# EasyEDA Pro project Aero1.epro

# Schematic Schematic1
Board Name: Board1; Create Date: 2025-12-23; Page Name: P1; Project Name: Aero1; Schematic Name: Schematic1; Update Date: 2025-12-22; Company: EasyEDA.com; Page Size: A4; Version: V1.0
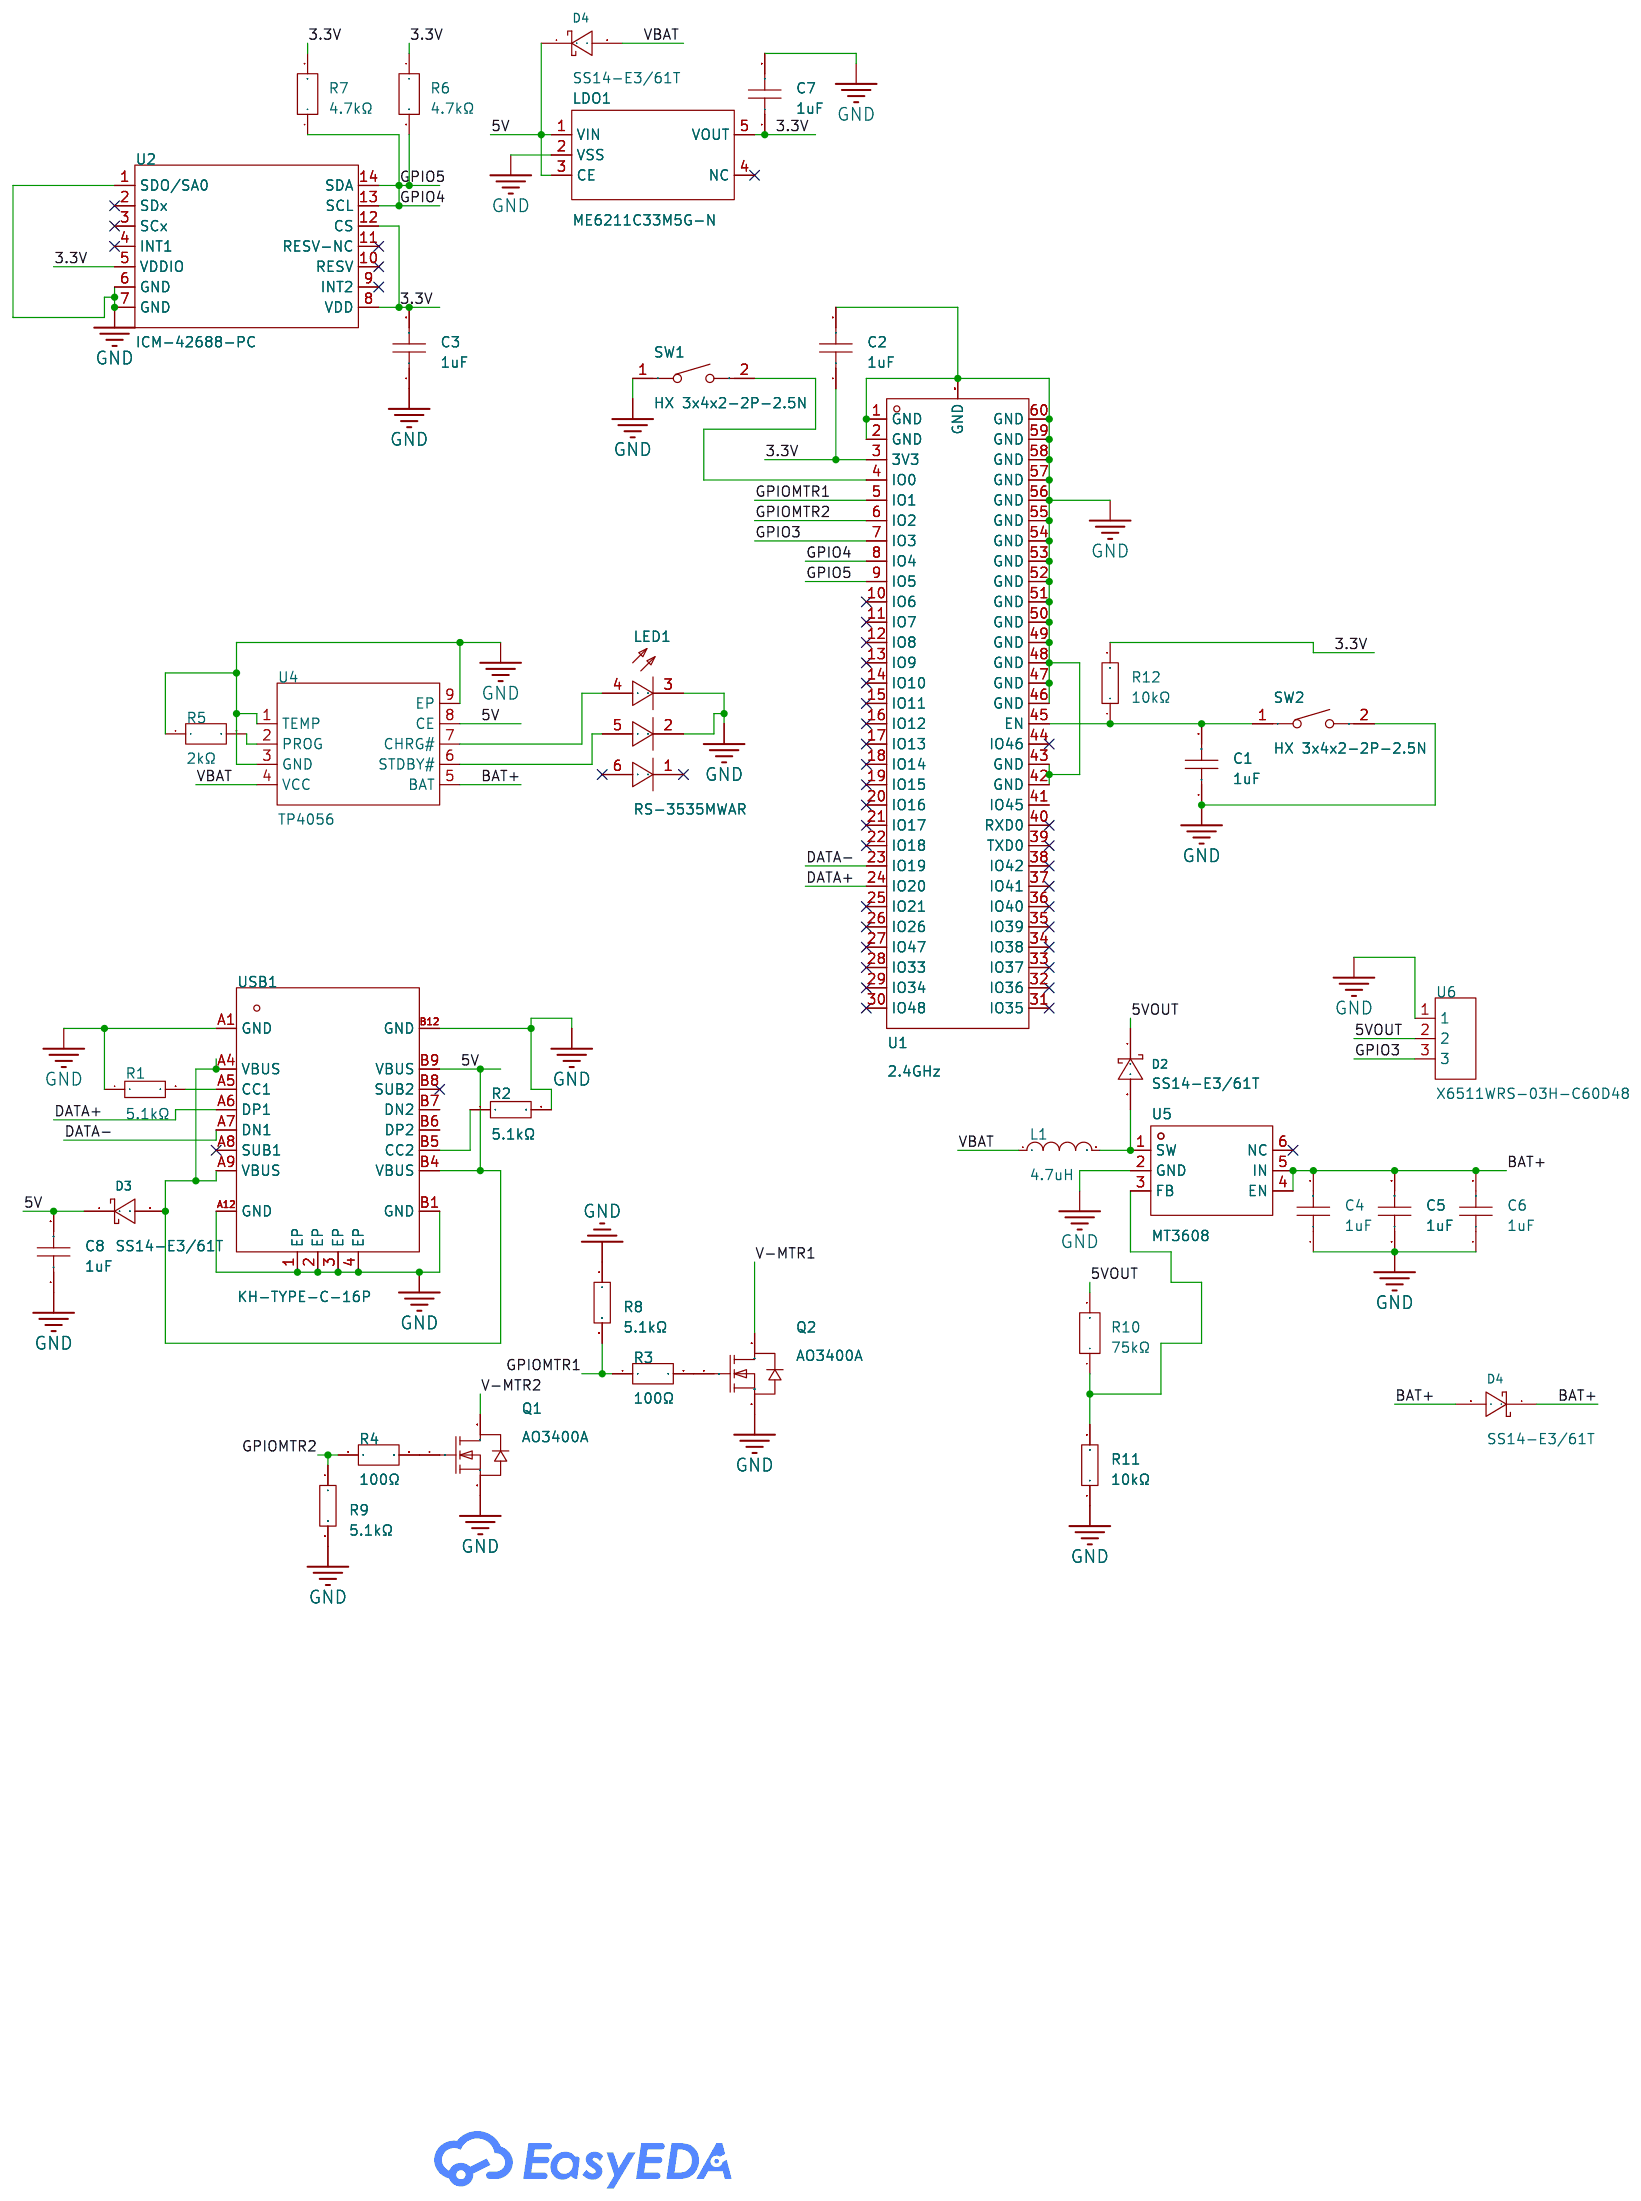
[diagram p0: schematic sheet]

## Parts
C1  1uF  [C1206]
C2  1uF  [C1206]
C3  1uF  [C1206]
C4  1uF  [C1206]
C5  1uF  [C1206]
C6  1uF  [C1206]
C7  1uF  [C1206]
C8  1uF  [C1206]
D2  SS14-E3/61T  [SMA_L4.3-W2.6-LS5.2-RD]
D3  SS14-E3/61T  [SMA_L4.3-W2.6-LS5.2-RD]
D4  SS14-E3/61T  [SMA_L4.3-W2.6-LS5.2-RD]
D4#2  SS14-E3/61T  [SMA_L4.3-W2.6-LS5.2-RD]
L1  4.7uH  [IND-SMD_L3.5-W3.0_ZECD32]
LDO1  ME6211C33M5G-N  [SOT-23-5_L3.0-W1.7-P0.95-LS2.8-BL]
LED1  RS-3535MWAR  [LED-SMD_RS-3535MWAR-2JYJY-J]
Q1  AO3400A  [SOT-23-3_L2.9-W1.3-P1.90-LS2.4-BR]
Q2  AO3400A  [SOT-23-3_L2.9-W1.3-P1.90-LS2.4-BR]
R1  5.1kΩ  [R1206]
R2  5.1kΩ  [R1206]
R3  100Ω  [R2512]
R4  100Ω  [R2512]
R5  2kΩ  [R1206]
R6  4.7kΩ  [R1206]
R7  4.7kΩ  [R1206]
R8  5.1kΩ  [R1206]
R9  5.1kΩ  [R1206]
R10  75kΩ  [R1206]
R11  10kΩ  [R1206]
R12  10kΩ  [R1206]
SW1  HX 3x4x2-2P-2.5N  [SW-SMD_L4.0-W2.9-LS5.0]
SW2  HX 3x4x2-2P-2.5N  [SW-SMD_L4.0-W2.9-LS5.0]
U1  2.4GHz  [BULETM-SMD_ESP32-S3-MINI-1-N8]
U2  ICM-42688-PC  [LGA-14_L3.0-W2.5-P0.50-TL]
U4  TP4056  [ESOP-8_L4.9-W3.9-P1.27-LS6.0-BL-EP]
U5  MT3608  [SOT-23-6_L2.9-W1.6-P0.95-LS2.8-BL]
U6  X6511WRS-03H-C60D48  [HDR-SMD_3P-P2.54-H-M-W13.3-N]
USB1  KH-TYPE-C-16P  [USB-C-SMD_KH-TYPE-C-16P]

## Library data of the parts
C1-C8 = CL31B105KBHNNNE: Capacitance:1uF Tolerance:±10% Tolerance:±10% Voltage Rating:50V Temperature Coefficient:X7R; LCSC Part Name: 1uF ±10% 50V; Supplier Part: C1848; Manufacturer: SAMSUNG(三星); Supplier Footprint: 1206; JLCPCB Part Class: Basic Part; Datasheet: https://item.szlcsc.com/datasheet/CL31B105KBHNNNE/2200.html; Supplier: LCSC; Tolerance: ±10%; Voltage Rating: 50V; Temperature Coefficient: X7R
D2-D4 D4#2 = SS14-E3/61T: Diode Configuration:1 Independent Voltage - Forward(Vf@If):500mV@1A Voltage - DC Reverse(Vr):40V Current - Rectified:1A Reverse Leakage Current (Ir):200uA@40V Operating Junction Temperature Range:-65℃~+150℃ Operating Junction Temperature Range:-65℃~+150℃; LCSC Part Name: 电压:40V 电流:1A; Supplier Part: C47460; Manufacturer: VISHAY(威世); Supplier Footprint: SMA(DO-214AC); JLCPCB Part Class: Extended Part; Datasheet: https://item.szlcsc.com/datasheet/SS14-E3%252F61T/48465.html; Supplier: LCSC; Diode Configuration: 1 Independent; Voltage - Forward(Vf@If): 500mV@1A; Voltage - DC Reverse(Vr): 40V; Current - Rectified: 1A; Reverse Leakage Current (Ir): 200uA@40V; Operating Junction Temperature Range: -65℃~+150℃; Non-Repetitive Peak Forward Surge Current: 40A
L1 = ZECD32-4R7M: Inductance:4.7uH Tolerance:±20% Tolerance:±20% Current Rating:1.5A DC Resistance(DCR):137mΩ Type:Unshielded Inductor; LCSC Part Name: 4.7uH ±20%; Supplier Part: C41408466; Manufacturer: ZE(增益); Supplier Footprint: SMD,3.5x3mm; JLCPCB Part Class: Extended Part; Datasheet: https://item.szlcsc.com/datasheet/ZECD32-4R7M/43210229.html; Supplier: LCSC; Tolerance: ±20%; Current Rating: 1.5A; DC Resistance(DCR): 137mΩ; Type: Unshielded Inductor
LDO1 = ME6211C33M5G-N: Output Type:Fixed Voltage - Supply:6V Output Voltage:3.3V Output Voltage:3.3V Output Current:500mA Power Supply Rejection Ratio (PSRR):70dB@(1kHz) Voltage Dropout:120mV@(100mA) standby current:60uA Noise:50uVrms Features:Over Current Protection；Enable；Sho; LCSC Part Name: 输入6V 输出3.3V 500mA; Supplier Part: C82942; Manufacturer: MICRONE(南京微盟); Supplier Footprint: SOT-23-5; JLCPCB Part Class: Extended Part; Datasheet: https://item.szlcsc.com/datasheet/ME6211C33M5G-N/84106.html; Supplier: LCSC; Output Type: Fixed; Voltage - Supply: 6V; Output Voltage: 3.3V; Output Current: 500mA; Power Supply Rejection Ratio (PSRR): 70dB@(1kHz); Voltage Dropout: 120mV@(100mA); standby current: 60uA; Noise: 50uVrms; Features: Over Current Protection；Enable；Short Circuit Protection; Operating Temperature: -40℃~+150℃; Output Configuration: Positive; Number of Outputs: 1
LED1 = RS-3535MWAR: Diode Configuration:Discrete Diode Wavelength - Dominant:G:527nm；R:622nm；B:471nm Luminous Intensity:G:2200mcd；R:950mcd；B:500mcd Viewing Angle:110° Forward Current:R:20mA；B:20mA；G:20mA Forward Voltage(Vf):R:2V；G:2.9V；B:2.9V Installation Method:op View Moun; LCSC Part Name: TOP全彩LED; Supplier Part: C110402; Manufacturer: 国星光电; Supplier Footprint: SMD3535-6P; JLCPCB Part Class: Extended Part; Datasheet: https://item.szlcsc.com/datasheet/RS-3535MWAR/111625.html; Supplier: LCSC; Diode Configuration: Discrete Diode; Wavelength - Dominant: G:527nm；R:622nm；B:471nm; Luminous Intensity: G:2200mcd；R:950mcd；B:500mcd; Viewing Angle: 110°; Forward Current: R:20mA；B:20mA；G:20mA; Forward Voltage(Vf): R:2V；G:2.9V；B:2.9V; Installation Method: op View Mount; Operating Temperature: -30℃~+85℃
Q1 Q2 = AO3400A_C20917: Number:- Drain to Source Voltage:30V Current - Continuous Drain(Id):- RDS(on):48mΩ@2.5V Pd - Power Dissipation:- Gate Threshold Voltage (Vgs(th)):1.45V@250uA Gate Charge(Qg):7nC@10V Input Capacitance(Ciss):630pF@15V Reverse Transfer Capacitance (Crss@Vds); LCSC Part Name: 1个N沟道 耐压:30V 电流:5.7A; Supplier Part: C20917; Manufacturer: AOS; Supplier Footprint: SOT-23-3L; JLCPCB Part Class: Basic Part; Datasheet: https://item.szlcsc.com/datasheet/AO3400A/21629.html; Supplier: LCSC; Drain to Source Voltage: 30V; RDS(on): 48mΩ@2.5V; Gate Threshold Voltage (Vgs(th)): 1.45V@250uA; Gate Charge(Qg): 7nC@10V; Input Capacitance(Ciss): 630pF@15V; Operating Temperature: -55℃~+150℃@(Tj); Type: N-Channel
R1 R2 R8 R9 = RC1206FR-075K1L: Type:Thick Film Resistor Resistance:5.1kΩ Tolerance:±1% Tolerance:±1% Power(Watts):250mW Voltage-Supply(Max):200V Temperature Coefficient:±100ppm/℃ Temperature Coefficient:±100ppm/℃ Operating Temperature:-55℃~+155℃ Operating Temperature:-55℃~+155℃; LCSC Part Name: 厚膜电阻 5.1kΩ ±1% 250mW; Supplier Part: C163372; Manufacturer: YAGEO(国巨); Supplier Footprint: 1206; JLCPCB Part Class: Extended Part; Datasheet: https://item.szlcsc.com/datasheet/RC1206FR-075K1L/174753.html; Supplier: LCSC; Type: Thick Film Resistor; Tolerance: ±1%; Power(Watts): 250mW; Voltage-Supply(Max): 200V; Temperature Coefficient: ±100ppm/℃; Operating Temperature: -55℃~+155℃
R3 R4 = FRP2512F1000TS: Type:Thick Film Resistor Resistance:100Ω Tolerance:±1% Tolerance:±1% Power(Watts):2W Voltage-Supply(Max):200V Temperature Coefficient:±200ppm/℃ Temperature Coefficient:±200ppm/℃ Operating Temperature:-55℃~+155℃ Operating Temperature:-55℃~+155℃; LCSC Part Name: 100Ω ±1% 2W 厚膜电阻; Supplier Part: C5126189; Manufacturer: FOJAN(富捷); Supplier Footprint: 2512; JLCPCB Part Class: Extended Part; Supplier: LCSC; Type: Thick Film Resistor; Tolerance: ±1%; Power(Watts): 2W; Voltage-Supply(Max): 200V; Temperature Coefficient: ±200ppm/℃; Operating Temperature: -55℃~+155℃
R5 = FRC1206J202 TS: Type:Thick Film Resistor Resistance:2kΩ Tolerance:±5% Tolerance:±5% Power(Watts):250mW Voltage-Supply(Max):200V Temperature Coefficient:±100ppm/℃ Temperature Coefficient:±100ppm/℃ Operating Temperature:-55℃~+155℃ Operating Temperature:-55℃~+155℃; LCSC Part Name: 2kΩ ±5% 250mW 厚膜电阻; Supplier Part: C2907466; Manufacturer: FOJAN(富捷); Supplier Footprint: 1206; JLCPCB Part Class: Extended Part; Supplier: LCSC; Type: Thick Film Resistor; Tolerance: ±5%; Power(Watts): 250mW; Voltage-Supply(Max): 200V; Temperature Coefficient: ±100ppm/℃; Operating Temperature: -55℃~+155℃
R6 R7 = FRC1206J472 TS: Type:Thick Film Resistor Resistance:4.7kΩ Tolerance:±5% Tolerance:±5% Power(Watts):250mW Voltage-Supply(Max):200V Temperature Coefficient:±100ppm/℃ Temperature Coefficient:±100ppm/℃ Operating Temperature:-55℃~+155℃ Operating Temperature:-55℃~+155℃; LCSC Part Name: 4.7kΩ ±5% 250mW 厚膜电阻; Supplier Part: C2907499; Manufacturer: FOJAN(富捷); Supplier Footprint: 1206; JLCPCB Part Class: Extended Part; Supplier: LCSC; Type: Thick Film Resistor; Tolerance: ±5%; Power(Watts): 250mW; Voltage-Supply(Max): 200V; Temperature Coefficient: ±100ppm/℃; Operating Temperature: -55℃~+155℃
R10 = FRC1206J753TS: Type:Thick Film Resistor Resistance:75kΩ Tolerance:±5% Tolerance:±5% Power(Watts):250mW Voltage-Supply(Max):200V Temperature Coefficient:±100ppm/℃ Temperature Coefficient:±100ppm/℃ Operating Temperature:-55℃~+155℃ Operating Temperature:-55℃~+155℃; LCSC Part Name: 75kΩ ±5% 250mW 厚膜电阻; Supplier Part: C2930384; Manufacturer: FOJAN(富捷); Supplier Footprint: 1206; JLCPCB Part Class: Extended Part; Supplier: LCSC; Type: Thick Film Resistor; Tolerance: ±5%; Power(Watts): 250mW; Voltage-Supply(Max): 200V; Temperature Coefficient: ±100ppm/℃; Operating Temperature: -55℃~+155℃
R11 R12 = WR12X103JTL: Type:Thick Film Resistors Resistance: Tolerance:±5% Tolerance:±5% Power(Watts):250mW Overload Voltage (Max): Temperature Coefficient:±100ppm/℃ Temperature Coefficient:±100ppm/℃ Operating Temperature Range:-55℃~+155℃ Operating Temperature Range:-55℃~+155℃; LCSC Part Name: 厚膜电阻 10kΩ ±5% 250mW; Supplier Part: C164022; Manufacturer: Walsin(华新科); Supplier Footprint: 1206; JLCPCB Part Class: Extended Part; Datasheet: https://atta.szlcsc.com/upload/public/pdf/source/20191217/C470038_A24AAB334905FB0194AB4BFA4498611E.pdf; Supplier: LCSC; Type: Thick Film Resistors; Tolerance: ±5%; Power(Watts): 250mW; Temperature Coefficient: ±100ppm/℃; Operating Temperature Range: -55℃~+155℃
SW1 SW2 = HX 3x4x2-2P-2.5N: Circuit:SPST Actuator Style:Round Button Operating Force:2.5N Mounting Type:Surface Mount,Vertical Length:4mm Width:3mm Switch Height:2mm with Bracket:Without Bracket Contact Current:50mA Voltage Rating:12V Actuator/Cap Color:Black With Lamp:No IP Rating:; LCSC Part Name: 4*3*2mm 立贴 轻触开关; Supplier Part: C36498961; Manufacturer: hanxia(韩下); Supplier Footprint: SMD,3x4mm; JLCPCB Part Class: Extended Part; Datasheet: https://item.szlcsc.com/datasheet/HX%25203x4x2-2P-2.5N/38220903.html; Supplier: LCSC; Circuit: SPST; Actuator Style: Round Button; Operating Force: 2.5N; Mounting Type: Surface Mount,Vertical; Length: 4mm; Width: 3mm; Switch Height: 2mm; with Bracket: Without Bracket; Contact Current: 50mA; Voltage Rating: 12V; Actuator/Cap Color: Black; With Lamp: No; Termination Style: SMD(SMT) Tab; Life: 100,000 Cycles
U1 = ESP32-S3-MINI-1-N8: Core Processor:ESP32-S3FN8 Chip Wireless Standard:- Support Interface:I2C；GPIO；SPI；PWM；ADC；UART；USB；I2S Frequency:2.4GHz Antenna Type:- Output Power:20.5dBm Output Power:20.5dBm Operating Voltage:- Operating Voltage:- Receive  Current:- Send  Current:- Se; Supplier Part: C2913206; Manufacturer: ESPRESSIF(乐鑫); Supplier Footprint: SMD; JLCPCB Part Class: Extended Part; Datasheet: https://atta.szlcsc.com/upload/public/pdf/source/20220425/7F117D7A09F85946280540FD9EFDF9F3.pdf; Supplier: LCSC; Core Processor: ESP32-S3FN8 Chip; Support Interface: I2C；GPIO；SPI；PWM；ADC；UART；USB；I2S; Output Power: 20.5dBm
U2 = ICM-42688-PC: Accelerometer Sensing Axis:X,Y,Z Acceleration Measurement Range (MAX):±16g Acceleration Measurement Range (MAX):±16g Gyroscope Sensing Axis:X,Y,Z Gyroscope Measurement Range (MAX):±2048dps Gyroscope Measurement Range (MAX):±2048dps Sensor Type:IMU Output; LCSC Part Name: 低噪声、宽带宽6D惯性测量单元，带运动协处理器; Supplier Part: C48586483; Manufacturer: Tokmas(托克马斯); Supplier Footprint: LGA-14(2.5x3); JLCPCB Part Class: Extended Part; Datasheet: https://item.szlcsc.com/datasheet/ICM-42688-PC/50854565.html; Supplier: LCSC; Accelerometer Sensing Axis: X,Y,Z; Acceleration Measurement Range (MAX): ±16g; Gyroscope Sensing Axis: X,Y,Z; Gyroscope Measurement Range (MAX): ±2048dps; Sensor Type: IMU; Output Bits: 16bit; Interface: I3C；I2C；SPI; Voltage - Supply: 1.71V~3.6V; Cache Size: 1.5KB; Operating Temperature: -40℃~+85℃
U4 = TP4056_C725790: The Chip Type:Linear Charging IC Voltage - Supply:3.7V~6.5V Voltage - Supply:3.7V~6.5V Charge Current - Max:1A Charging Saturation Voltage:4.2V Type of Battery:Lithium-ion Number of Cells:1 Number of Cells:1 Operating Temperature:-40℃~+85℃ Operating Tempe; LCSC Part Name: 1A独立式线性锂离子电池充电器; Supplier Part: C725790; Manufacturer: UMW(友台半导体); Supplier Footprint: ESOP-8; JLCPCB Part Class: Extended Part; Datasheet: https://item.szlcsc.com/datasheet/TP4056/772193.html; Supplier: LCSC; The Chip Type: Linear Charging IC; Voltage - Supply: 3.7V~6.5V; Charge Current - Max: 1A; Charging Saturation Voltage: 4.2V; Type of Battery: Lithium-ion; Number of Cells: 1; Operating Temperature: -40℃~+85℃; Battery Temperature Detection: Support; 0V Battery Charge: Support; Supply Current (Iq): 35uA
U5 = MT3608: Function:Boost Output Type:Adjustable Voltage - Supply:2V~24V Voltage - Supply:2V~24V Output Voltage:- Output Voltage:- Output Current:2A Frequency - Switching:1.2MHz Frequency - Switching:1.2MHz Operating Temperature:-40℃~+85℃ Operating Temperature:-40℃~; LCSC Part Name: 老版本 高效1.2MHz 2A升压转换器; Supplier Part: C84817; Manufacturer: 西安航天民芯; Supplier Footprint: SOT-23-6; JLCPCB Part Class: Extended Part; Datasheet: https://item.szlcsc.com/datasheet/MT3608/85988.html; Supplier: LCSC; Function: Boost; Output Type: Adjustable; Voltage - Supply: 2V~24V; Output Current: 2A; Frequency - Switching: 1.2MHz; Operating Temperature: -40℃~+85℃; Synchronous Rectifier: No; Number of Outputs: 1; Topology: Boost; Quiescent Current: 100uA；1.6mA; Switch tube (built-in/external): Built-in
U6 = X6511WRS-03H-C60D48: Pin Structure:1x3P Pitch:2.54mm Row Spacing:2.54mm Circluar Pins/Square Pins:Pin Header Number of Rows:1 Number of Pins:3P Current Rating:3A Voltage Rating (Max):250V Length of Mating Pin:- Insulation Height:2.5mm Length of End Connection Pin:- Contact Ma; LCSC Part Name: 1x3P 间距:2.54mm 方针; Supplier Part: C5242196; Manufacturer: XKB Connection(中国星坤); Supplier Footprint: SMD,P=2.54mm; JLCPCB Part Class: Extended Part; Datasheet: https://item.szlcsc.com/datasheet/X6511WRS-03H-C60D48/5950303.html; Supplier: LCSC; Pin Structure: 1x3P; Pitch: 2.54mm; Row Spacing: 2.54mm; Circluar Pins/Square Pins: Pin Header; Number of Rows: 1; Number of Pins: 3P; Current Rating: 3A; Voltage Rating (Max): 250V; Insulation Height: 2.5mm; Contact Material: Brass; Contact Plating: Gold; Operating Temperature: -40℃~+105℃; Color: Black
USB1 = KH-TYPE-C-16P: Connector Type:Type-C Standard:- Gender:Female Number of Ports:1 Number of Contacts:16P Mounting Style:卧贴 Current Rating - Power (Max):3A Operating Temperature Range:-40℃~+85℃ Operating Temperature Range:-40℃~+85℃; LCSC Part Name: Type-C 母 卧贴; Supplier Part: C709357; Manufacturer: kinghelm(金航标); Supplier Footprint: SMD; JLCPCB Part Class: Extended Part; Datasheet: https://atta.szlcsc.com/upload/public/pdf/source/20200911/C709357_AA8DCEB38BB20E3035A7ED7AE7667837.pdf; Supplier: LCSC; Connector Type: Type-C; Gender: Female; Number of Ports: 1; Number of Contacts: 16P; Mounting Style: 卧贴; Current Rating - Power (Max): 3A; Operating Temperature Range: -40℃~+85℃

## Nets
3.3V: C2.1 C3.2 C7.1 LDO1.5(VOUT) R6.1 R7.2 R12.2 U1.3(3V3) U2.5(VDDIO) U2.8(VDD) U2.12(CS)
5V: C8.2 D3.1(K) D3.2(A) D4.1(K) LDO1.1(VIN) LDO1.3(CE) U4.8(CE) USB1.A4(VBUS) USB1.A9(VBUS) USB1.B4(VBUS) USB1.B9(VBUS)
5VOUT: D2.1(K) R10.2 U6.2
GND: C1.1 C2.2 C3.1 C4.1 C5.1 C6.1 C7.2 C8.1 LDO1.2(VSS) LED1.2(K) LED1.3(K) Q1.2(S) Q2.2(S) R1.1 R2.2 R5.1 R8.1 R9.2 R11.1 SW1.1 SW2.2 U1.1(GND) U1.2(GND) U1.42(GND) U1.43(GND) U1.46(GND) U1.47(GND) U1.48(GND) U1.49(GND) U1.50(GND) U1.51(GND) U1.52(GND) U1.53(GND) U1.54(GND) U1.55(GND) U1.56(GND) U1.57(GND) U1.58(GND) U1.59(GND) U1.60(GND) U1.GND U2.1(SDO/SA0) U2.6(GND) U2.7(GND) U4.1(TEMP) U4.3(GND) U4.9(EP) U5.2(GND) U6.1 USB1.1(EP) USB1.2(EP) USB1.3(EP) USB1.4(EP) USB1.A1(GND) USB1.A12(GND) USB1.B1(GND) USB1.B12(GND)
VBAT: D4.2(A) L1.1 U4.4(VCC)
BAT+: C4.2 C5.2 C6.2 D4#2.1(K) D4#2.2(A) U4.5(BAT) U5.4(EN) U5.5(IN)
DATA+: U1.24(IO20) USB1.A6(DP1)
DATA-: U1.23(IO19) USB1.A7(DN1)
GPIO3: U1.7(IO3) U6.3
GPIO4: R7.1 U1.8(IO4) U2.13(SCL)
GPIO5: R6.2 U1.9(IO5) U2.14(SDA)
GPIOMTR1: R3.1 R8.2 U1.5(IO1)
GPIOMTR2: R4.1 R9.1 U1.6(IO2)
V-MTR1: Q2.3(D)
V-MTR2: Q1.3(D)
$1N1566: R1.2 USB1.A5(CC1)
$1N1605: R2.1 USB1.B5(CC2)
$1N2351: Q2.1(G) R3.2
$1N2390: Q1.1(G) R4.2
$1N2578: R5.2 U4.2(PROG)
$1N2654: LED1.4(A) U4.7(CHRG#)
$1N2866: LED1.5(A) U4.6(STDBY#)
$1N3463: D2.2(A) L1.2 U5.1(SW)
$1N3668: R10.1 R11.2 U5.3(FB)
$1N3802: C1.2 R12.1 SW2.1 U1.45(EN)
$1N3847: SW1.2 U1.4(IO0)

Not connected (* = marked no-connect by the designer): LDO1 4(NC)*; LED1 1(K)* 6(A)*; U1 10(IO6)* 11(IO7)* 12(IO8)* 13(IO9)* 14(IO10)* 15(IO11)* 16(IO12)* 17(IO13)* 18(IO14)* 19(IO15)* 20(IO16)* 21(IO17)* 22(IO18)* 25(IO21)* 26(IO26)* 27(IO47)* 28(IO33)* 29(IO34)* 30(IO48)* 31(IO35)* 32(IO36)* 33(IO37)* 34(IO38)* 35(IO39)* 36(IO40)* 37(IO41)* 38(IO42)* 39(TXD0)* 40(RXD0)* 41(IO45) 44(IO46)*; U2 2(SDx)* 3(SCx)* 4(INT1)* 9(INT2)* 10(RESV)* 11(RESV-NC)*; U5 6(NC)*; USB1 A8(SUB1)* B6(DP2) B7(DN2) B8(SUB2)*

# Board PCB1
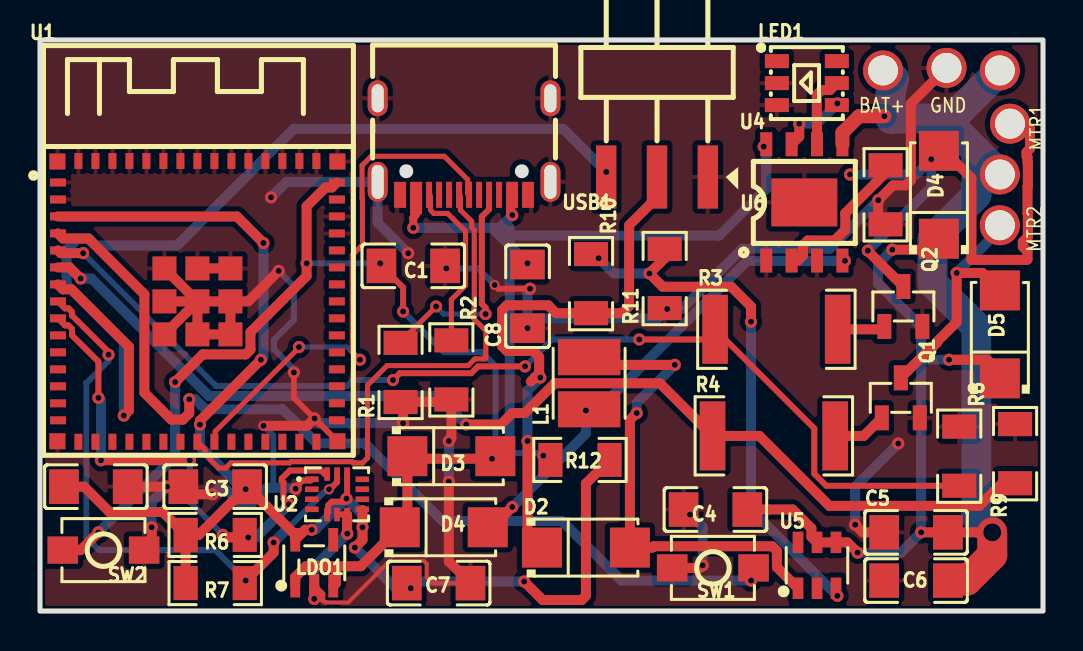
[diagram p1: board, top side]
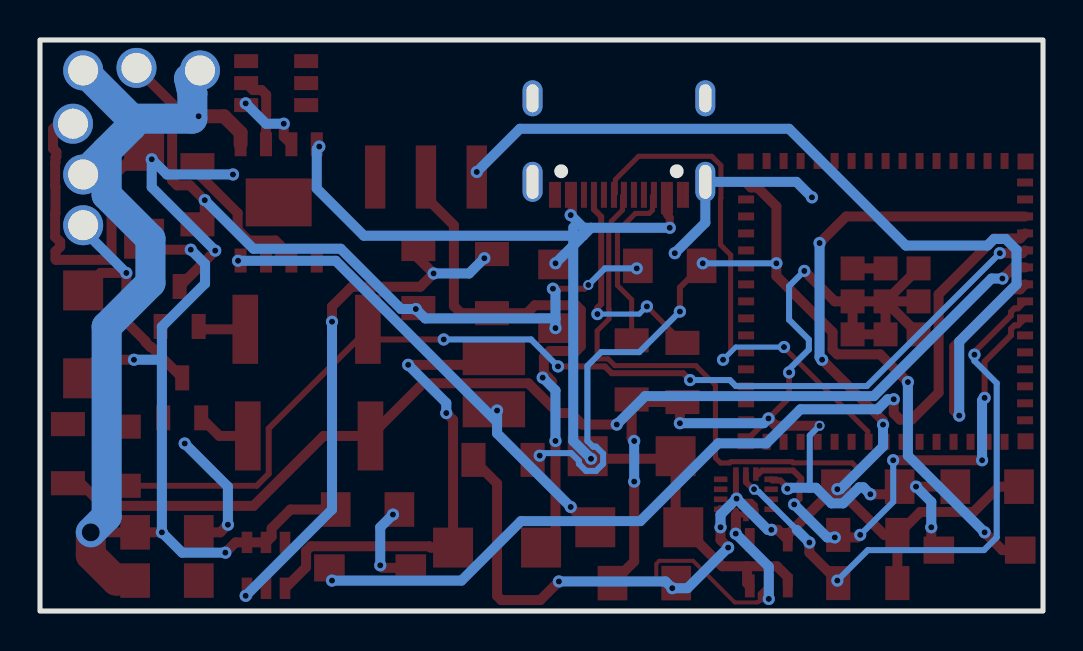
[diagram p2: board, bottom side, seen from below]

Outline 50.16 x 28.58 mm; copper layers: Top Layer, Bottom Layer. Coordinates in mm from the lower left corner of the outline.
Outline path: rectangle 0,28.58 50.16,0
Stack: Top Layer 0.035mm / Dielectric1 1.51mm FR4 er 4.5 / Bottom Layer 0.035mm

## Design rules (mm)
template: Custom Config
spacing copperThickness1oz (default): track to track 0.102, other pairs 0.152 to 0.3
spacing copperThickness2oz: track to track 0.203, other pairs 0.152 to 0.3
track width copperThickness1oz: min 0.127, default 0.254, max 2.54
track width copperThickness2oz: min 0.203, default 0.254, max 2.54
track width PWR_5v: min 0.127, default 0.5, max 2.54
track width PWR_3.3v (default): min 0.127, default 0.5, max 2.54
differential pair differentialPair (default): width min 0.127, default 0.254, max 2.54; gap min 0.152, default 0.152
via viaSize (default): diameter min 0.5, default 0.61, max 10; hole min 0.3, default 0.305, max 6.3

## Placement (name value [footprint] x y rotation side)
C1  1uF  [C1206]  18.67 17.27 180 top
C2  1uF  [C1206]  2.79 6.22 0 top
C3  1uF  [C1206]  8.76 6.22 0 top
C4  1uF  [C1206]  33.78 5.08 0 top
C5  1uF  [C1206]  43.81 3.94 0 top
C6  1uF  [C1206]  43.81 1.52 0 top
C7  1uF  [C1206]  19.94 1.4 0 top
C8  1uF  [C1206]  24.38 15.75 90 top
D2  SS14-E3/61T  [SMA_L4.3-W2.6-LS5.2-RD]  27.31 3.17 0 top
D3  SS14-E3/61T  [SMA_L4.3-W2.6-LS5.2-RD]  20.57 7.75 0 top
D4  SS14-E3/61T  [SMA_L4.3-W2.6-LS5.2-RD]  44.96 20.83 90 top
D4#2  SS14-E3/61T  [SMA_L4.3-W2.6-LS5.2-RD]  20.19 4.19 0 top
D5  SS14-E3/61T  [SMA_L4.3-W2.6-LS5.2-RD]  48.01 13.84 90 top
L1  4.7uH  [IND-SMD_L3.5-W3.0_ZECD32]  27.47 11.4 90 top
LDO1  ME6211C33M5G-N  [SOT-23-5_L3.0-W1.7-P0.95-LS2.8-BL]  13.72 2.41 0 top
LED1  RS-3535MWAR  [LED-SMD_RS-3535MWAR-2JYJY-J]  38.35 26.42 0 top
NOREF  -  [Pad_e51]  48.01 19.3 0 top
NOREF#2  -  [Pad_e49]  48.51 24.38 0 top
NOREF#3  -  [Pad_e48]  48.01 27.05 0 top
NOREF#4  -  [Pad_e50]  48.01 21.84 0 top
NOREF#5  -  [Pad_e46]  45.34 27.18 0 top
NOREF#6  -  [Pad_e45]  42.16 27.05 0 top
Q1  AO3400A  [SOT-23-3_L2.9-W1.3-P1.90-LS2.4-BR]  43.05 10.67 270 top
Q2  AO3400A  [SOT-23-3_L2.9-W1.3-P1.90-LS2.4-BR]  43.18 15.24 270 top
R1  5.1kΩ  [R1206]  18.03 11.94 90 top
R2  5.1kΩ  [R1206]  20.57 12.06 270 top
R3  100Ω  [R2512]  36.83 14.1 0 top
R4  100Ω  [R2512]  36.7 8.76 0 top
R5  2kΩ  [R1206]  42.29 20.83 90 top
R6  4.7kΩ  [R1206]  8.76 3.81 0 top
R7  4.7kΩ  [R1206]  8.76 1.4 180 top
R8  5.1kΩ  [R1206]  45.97 7.75 270 top
R9  5.1kΩ  [R1206]  48.77 7.87 90 top
R10  75kΩ  [R1206]  27.56 16.38 270 top
R11  10kΩ  [R1206]  31.24 16.64 90 top
R12  10kΩ  [R1206]  27.01 7.56 0 top
SW1  HX 3x4x2-2P-2.5N  [SW-SMD_L4.0-W2.9-LS5.0]  33.66 2.16 0 top
SW2  HX 3x4x2-2P-2.5N  [SW-SMD_L4.0-W2.9-LS5.0]  3.18 3.05 0 top
U1  2.4GHz  [BULETM-SMD_ESP32-S3-MINI-1-N8]  7.87 15.49 0 top
U2  ICM-42688-PC  [LGA-14_L3.0-W2.5-P0.50-TL]  14.86 5.84 0 top
U4  TP4056  [ESOP-8_L4.9-W3.9-P1.27-LS6.0-BL-EP]  38.23 20.45 0 top
U5  MT3608  [SOT-23-6_L2.9-W1.6-P0.95-LS2.8-BL]  38.86 2.29 0 top
U6  X6511WRS-03H-C60D48  [HDR-SMD_3P-P2.54-H-M-W13.3-N]  30.86 21.72 180 top
USB1  KH-TYPE-C-16P  [USB-C-SMD_KH-TYPE-C-16P]  21.21 23.24 180 top

## Footprints (pads in the part's own frame, mm; a bottom-side part is the same pattern mirrored in y, then rotated)
BULETM-SMD_ESP32-S3-MINI-1-N8
  rect 0.8x0.4 smd: 1(-6.975,5.95) 2(-6.975,5.1) 3(-6.975,4.25) 4(-6.975,3.4) 5(-6.975,2.55) 6(-6.975,1.7) 7(-6.975,0.85) 8(-6.975,0) 9(-6.975,-0.85) 10(-6.975,-1.7) 11(-6.975,-2.55) 12(-6.975,-3.4) 13(-6.975,-4.25) 14(-6.975,-5.1) 15(-6.975,-5.95) 31(6.975,-5.95) 32(6.975,-5.1) 33(6.975,-4.25) 34(6.975,-3.4) 35(6.975,-2.55) 36(6.975,-1.7) 37(6.975,-0.85) 38(6.975,0) 39(6.975,0.85) 40(6.975,1.7) 41(6.975,2.55) 42(6.975,3.4) 43(6.975,4.25) 44(6.975,5.1) 45(6.975,5.95)
  rect 0.4x0.8 smd: 16(-5.95,-7.025) 17(-5.1,-7.025) 18(-4.25,-7.025) 19(-3.4,-7.025) 20(-2.55,-7.025) 21(-1.7,-7.025) 22(-0.85,-7.025) 23(0,-7.025) 24(0.85,-7.025) 25(1.7,-7.025) 26(2.55,-7.025) 27(3.4,-7.025) 28(4.25,-7.025) 29(5.1,-7.025) 30(5.95,-7.025) 46(5.95,7.025) 47(5.1,7.025) 48(4.25,7.025) 49(3.4,7.025) 50(2.55,7.025) 51(1.7,7.025) 52(0.85,7.025) 53(0,7.025) 54(-0.85,7.025) 55(-1.7,7.025) 56(-2.55,7.025) 57(-3.4,7.025) 58(-4.25,7.025) 59(-5.1,7.025) 60(-5.95,7.025)
  rect 0.8x0.8 smd: GND(-7,7) GND(-7,-7) GND(7,7) GND(7,-7)
  rect 1.2x1.2 smd: GND(-1.65,1.65) GND(-1.65,0) GND(-1.65,-1.65) GND(0,1.65) GND(0,0) GND(0,-1.65) GND(1.65,1.65) GND(1.65,0) GND(1.65,-1.65)
C1206
  rect 1.485x1.728 smd: 1(-1.593,0) 2(1.593,0)
ESOP-8_L4.9-W3.9-P1.27-LS6.0-BL-EP
  rect 0.6x1.2 smd: 1(-1.905,-2.909) 2(-0.635,-2.909) 3(0.635,-2.909) 4(1.905,-2.909) 5(1.905,2.909) 6(0.635,2.909) 7(-0.635,2.909) 8(-1.905,2.909)
  rect 3.3x2.4 smd: 9(0,0)
HDR-SMD_3P-P2.54-H-M-W13.3-N
  rect 1.02x3.16 smd: 1(-2.54,0) 2(0,0) 3(2.54,0)
IND-SMD_L3.5-W3.0_ZECD32
  rect 1.8x3.12 smd: 1(-1.303,0) 2(1.303,0)
LED-SMD_RS-3535MWAR-2JYJY-J
  rect 1.2x0.7 smd: 1(-1.5,1.1) 2(-1.5,0) 3(-1.5,-1.1) 4(1.5,-1.1) 5(1.5,0.001) 6(1.5,1.1)
LGA-14_L3.0-W2.5-P0.50-TL
  rect 0.675x0.28 smd: 1(-1.262,0.75) 2(-1.262,0.25) 3(-1.262,-0.25) 4(-1.262,-0.75) 8(1.262,-0.75) 9(1.262,-0.25) 10(1.262,0.25) 11(1.262,0.75)
  rect 0.28x0.675 smd: 5(-0.5,-1.012) 6(0,-1.012) 7(0.5,-1.012) 12(0.5,1.012) 13(0,1.012) 14(-0.5,1.012)
Pad_e45
  round 2 hole 1.5: 1(0,0)
Pad_e46
  round 2 hole 1.5: 2(0,0)
Pad_e48
  round 2 hole 1.5: 1(0,0)
Pad_e49
  round 2 hole 1.5: 2(0,0)
Pad_e50
  round 2 hole 1.5: 1(0,0)
Pad_e51
  round 2 hole 1.5: 2(0,0)
R1206
  rect 1.208x1.701 smd: 1(-1.479,0) 2(1.479,0)
R2512
  rect 1.282x3.456 smd: 1(-3.067,0) 2(3.067,0)
SMA_L4.3-W2.6-LS5.2-RD
  rect 2x2 smd: 1(-2.2,0) 2(2.2,0)
SOT-23-3_L2.9-W1.3-P1.90-LS2.4-BR
  rect 1.25x0.7 smd: 1(1,-0.95) 2(1,0.95) 3(-1,0)
SOT-23-5_L3.0-W1.7-P0.95-LS2.8-BL
  rect 0.49x1.157 smd: 1(-0.95,-1.153) 2(0,-1.153) 3(0.95,-1.153)
  rect 0.49x1.175 smd: 4(0.95,1.153) 5(-0.95,1.153)
SOT-23-6_L2.9-W1.6-P0.95-LS2.8-BL
  rect 0.532x1.072 smd: 1(-0.95,-1.149) 2(0,-1.149) 3(0.95,-1.149) 4(0.95,1.149) 5(0,1.149) 6(-0.95,1.149)
SW-SMD_L4.0-W2.9-LS5.0
  rect 1.53x1.36 smd: 1(-2.035,0) 2(2.035,0)
USB-C-SMD_KH-TYPE-C-16P
  oval 1x2 hole 0.6x1.7: 1(-4.32,1.765) 2(4.32,1.765)
  oval 1x1.8 hole 0.6x1.4: 3(-4.32,-2.415) 4(4.32,-2.415)
  rect 0.3x1.3 smd: A1(-3.35,2.415) A4(-2.55,2.415) A5(-1.25,2.415) A6(-0.25,2.415) A7(0.25,2.415) A8(1.25,2.415) A9(2.55,2.415) A12(3.35,2.415) B1(3.05,2.415) B4(2.25,2.415) B5(1.75,2.415) B6(0.75,2.415) B7(-0.75,2.415) B8(-1.75,2.415) B9(-2.25,2.415) B12(-3.05,2.415)

## Nets
3.3V: C2.1 C3.2 C7.1 LDO1.5 R6.1 R7.2 R12.2 U1.3 U2.5 U2.8 U2.12
5V: C8.2 D3.1 D3.2 D4#2.1 LDO1.1 LDO1.3 U4.8 USB1.A4 USB1.A9 USB1.B4 USB1.B9
5VOUT: D2.1 R10.2 U6.2
GND: C1.1 C2.2 C3.1 C4.1 C5.1 C6.1 C7.2 C8.1 LDO1.2 LED1.2 LED1.3 NOREF#5.2 Q1.2 Q2.2 R1.1 R2.2 R5.1 R8.1 R9.2 R11.1 SW1.1 SW2.2 U1.1 U1.2 U1.42 U1.43 U1.46 U1.47 U1.48 U1.49 U1.50 U1.51 U1.52 U1.53 U1.54 U1.55 U1.56 U1.57 U1.58 U1.59 U1.60 U1.GND U2.1 U2.6 U2.7 U4.1 U4.3 U4.9 U5.2 U6.1 USB1.1 USB1.2 USB1.3 USB1.4 USB1.A1 USB1.A12 USB1.B1 USB1.B12
VBAT: D4#2.2 L1.1 U4.4
BAT+: C4.2 C5.2 C6.2 D4.1 D5.1 NOREF#3.1 NOREF#4.1 NOREF#6.1 U4.5 U5.4 U5.5
DATA+: U1.24 USB1.A6
DATA-: U1.23 USB1.A7
GPIO3: U1.7 U6.3
GPIO4: R7.1 U1.8 U2.13
GPIO5: R6.2 U1.9 U2.14
GPIOMTR1: R3.1 R8.2 U1.5
GPIOMTR2: R4.1 R9.1 U1.6
V-MTR1: D4.2 NOREF#2.2 Q2.3
V-MTR2: D5.2 NOREF.2 Q1.3
$1N1566: R1.2 USB1.A5
$1N1605: R2.1 USB1.B5
$1N2351: Q2.1 R3.2
$1N2390: Q1.1 R4.2
$1N2578: R5.2 U4.2
$1N2654: LED1.4 U4.7
$1N2866: LED1.5 U4.6
$1N3463: D2.2 L1.2 U5.1
$1N3668: R10.1 R11.2 U5.3
$1N3802: C1.2 R12.1 SW2.1 U1.45
$1N3847: SW1.2 U1.4

Pads without a net: LDO1 4; LED1 1 6; U1 10 11 12 13 14 15 16 17 18 19 20 21 22 25 26 27 28 29 30 31 32 33 34 35 36 37 38 39 40 41 44; U2 2 3 4 9 10 11; U5 6; USB1 A8 B6 B7 B8

## Via types
v1: diameter 0.61, hole 0.305, Top Layer to Bottom Layer, 89 vias
v2: diameter 0.5, hole 0.3, Top Layer to Bottom Layer, 2 vias
v3: diameter 0.5, hole 0.305, Top Layer to Bottom Layer, 1 via
v4: diameter 1.2, hole 0.9, Top Layer to Bottom Layer, 1 via

## Routing (per net, layer and track width the routed paths; a pad name or vN(x,y) marks a point on that pad's centre or on a via; arc(x,y) is an arc through that point)
3.3V: length 73.1
  Top Layer w0.3: U2.5 14.36,4.87 14.42,4.93 14.42,5.29 14.59,5.47 15.17,5.47 v1(15.33,5.62) 15.36,5.66 U2.12
  Top Layer w0.5: v1(15.75,3.17) 16.13,3.56 v1(16.13,4.19) 16.13,5.04 16.12,5.05 ; v1(11.18,18.41) 9.85,19.74 U1.3 ; 8,9.27 8,9.53 v1(11.05,12.57) ; R6.1 6.14,4.96 3.48,4.96 2.21,6.22 C2.1 ; R6.1 7.94,3.81 C3.2 12.77,3.81 LDO1.5 13.26,4.06 v1(13.59,4.06) ; R6.1 R7.2 ; v1(24.21,1.48) 25.14,0.55 27.09,0.55 27.31,0.76 27.31,6.38 R12.2
  Bottom Layer w0.5: v1(11.05,12.57) 11.18,12.7 v1(11.18,18.41) ; v1(15.75,3.17) 17.78,1.14 v1(18.54,1.14) 18.88,1.48 v1(24.21,1.48) ; v1(16.13,4.19) 16.13,4.82 v1(15.33,5.62) 13.77,4.06 v1(13.59,4.06) ; v1(10.29,6.1) 10.14,6.1 8,8.23 v1(8,9.33)
5V: length 56.9
  Top Layer w0.3: USB1.B9 23.46,20.78 23.5,20.74 23.46,20.69 23.46,19.97 v1(23.62,19.81) 23.62,20.69 USB1.A4 ; USB1.B4 18.96,19.97 18.8,19.81 18.66,19.95 USB1.A9
  Top Layer w0.4: v1(18.67,19.18) 18.67,19.69 18.8,19.81
  Top Layer w0.5: LDO1.3 14.8,1.39 14.8,2.24 ; v1(22.61,7.62) 18.5,7.62 18.37,7.75 18.37,4.57 D4#2.1 16.04,2.24 14.8,2.24 ; 14.8,2.24 13.3,2.24 12.77,1.7 LDO1.1
  Bottom Layer w0.5: v1(22.61,7.62) 23.5,8.51 23.5,18.29 ; 23.5,18.29 v1(24.38,17.4) ; 23.5,18.29 23.5,18.78 ; 23.5,18.29 23,18.78 ; 23.5,19.19 23.5,18.78 ; 23.5,18.78 33.96,18.78 36.32,21.14 36.32,23.11 v1(36.19,23.24) ; 23.5,18.78 23,18.78 ; 22.61,19.18 23,18.78 ; 22.61,19.18 22.99,19.18 v1(23.62,19.81) ; 22.61,19.18 v1(18.67,19.18)
5VOUT: length 28.4
  Top Layer w0.5: 24.75,11.68 24.96,11.9 24.96,12.71 24.66,13.01 23.35,13.01 23.12,13.25 23.12,15.06 23.35,15.3 25.41,15.3 25.81,14.9 R10.2 29.11,14.9 29.46,15.26 29.46,19.3 30.86,20.7 U6.2 ; 24.75,11.68 v1(25.02,11.68) ; 24.75,11.68 24.55,11.48 ; D2.1 24.38,3.9 v1(24.38,8.51)
  Bottom Layer w0.5: v1(24.38,8.51) 24.38,11.04 v1(25.02,11.68)
GND: length 139.3
  Top Layer w0.2: 14.12,0.56 14.23,0.44 14.3,0.44 14.32,0.43 15.42,0.43 17.5,2.51 19.19,2.51 19.34,2.37 19.34,1.68 19.63,1.4 C7.2
  Top Layer w0.29: v1(12.7,11.94) 12.7,10.67 v1(13.73,9.64) U1.GND
  Top Layer w0.3: v1(12.79,6.12) 12.79,6.19 13.13,6.53 13.54,6.53 U2.1 ; U2.7 U2.6 ; v1(24.51,16.13) 22.93,16.13 v2(22.74,16.32) ; LDO1.2 14.12,0.86 14.12,0.56
  Top Layer w0.5: SW1.1 33.02,2.16 v1(33.15,2.29) ; U1.GND U1.GND ; U1.GND 10.41,15.49 v1(11.94,17.02) ; U1.GND 9.52,14.12 ; U1.GND 8.13,15.49 ; C5.1 41.15,3.94 v1(40.77,4.32) ; C2.2 v1(6.35,6.22) C3.1 7.55,5.84 v1(8.64,5.84) ; U1.GND 6.22,17.14 ; U1.GND 6.22,13.84 ; U1.GND 6.22,15.49 ; 9.52,14.12 U1.GND ; 9.52,14.12 9.25,13.84 U1.GND 7.87,14.99 8.13,15.24 ; LDO1.2 13.72,0.55 ; R5.1 41.92,19.72 v1(41.92,20.56) 42.67,21.3 43.31,21.3 43.56,21.55 43.56,25.39 NOREF#5.2 ; v1(18.16,9.4) 18.16,10.33 R1.1 20.45,10.46 R2.2 20.57,8.64 v1(20.45,8.51) ; v1(20.45,6.48) 20.45,2.48 C7.2 ; SW2.2 5.21,3.11 5.59,3.48 v1(5.59,4.19) ; v1(13.73,9.64) 13.37,9.27 v3(11.18,9.27) ; U2.7 15.36,3.88
  Bottom Layer w0.3: v3(11.18,9.27) 11.67,8.78 11.67,6.17 ; v1(20.32,17.14) 21.91,17.14 v2(22.74,16.32) ; v1(12.7,11.94) 12.7,12.1 11.71,13.08 11.71,13.59 12.7,14.57 12.7,16.26 v1(11.94,17.02)
  Bottom Layer w0.5: v1(42.93,8.38) 40.77,6.22 v1(40.77,4.32) ; v1(15.37,3.87) 13.72,2.22 v1(13.72,0.61) ; v1(18.16,9.4) 13.97,9.4 v1(13.73,9.64) ; v1(20.45,8.51) v1(20.45,6.48) ; v1(33.15,2.29) 33.15,4.19 v1(32.51,4.83) ; v1(41.92,20.56) 39.49,18.13 35.13,18.13 32.11,15.11 v1(31.37,15.11) 30.9,14.64 24.38,14.64 ; v1(12.79,6.12) 12.66,6.12 12.61,6.17 11.36,6.17 10.58,5.39 9.99,5.39 9.19,6.19 8.98,6.19 v1(8.64,5.84) ; v1(6.35,6.22) 5.59,5.46 v1(5.59,4.19) ; v1(11.56,20.7) 12.33,21.48 USB1.2 16.89,19.43 v1(18.41,17.91) ; v1(24.38,14.16) 24.38,14.64 ; 24.38,14.64 24.38,16 v1(24.51,16.13)
VBAT: length 24.3
  Top Layer w0.5: D4#2.2 22.61,4.19 v1(23.62,5.21)
  Bottom Layer w0.5: 27.31,9.46 v1(27.31,10.03) ; 27.31,9.46 35.38,17.53 v1(40.26,17.53) ; 27.31,9.46 27.31,8.89 v1(23.62,5.21)
BAT+: length 77
  Top Layer w0.5: v1(42.62,18.08) 44.41,18.08 D4.1 ; 48.01,12.15 47.79,12.15 47.37,12.57 v1(45.47,12.57) ; v1(44.07,3.94) C5.2 v4(47.62,3.94) ; C4.2 37.64,5.08 38.58,4.14 38.58,3.72 U5.5 40.38,3.44 v1(40.89,2.92)
  Top Layer w0.7: v1(42.23,24.76) 40.96,24.76 40.13,23.93 U4.5
  Top Layer w1.5: v4(47.62,3.94) 47.62,2.79 46.36,1.52 C6.2
  Bottom Layer w0.5: 44.07,12.68 v1(44.07,3.94) 43.05,2.92 v1(40.89,2.92) ; 44.07,12.68 44.18,12.57 v1(45.47,12.57) ; 44.07,12.68 44.07,14.22 41.91,16.38 41.91,17.37 v1(42.62,18.08)
  Bottom Layer w1.5: 45.59,24.64 45.59,24.26 46.83,23.02 ; 45.59,24.64 42.55,24.64 42.55,25.91 42.71,26.65 42.57,26.65 NOREF#6.1 ; 45.59,24.64 NOREF#3.1 ; v4(47.62,3.94) 46.83,4.73 46.83,14.23 44.64,16.42 44.64,18.63 46.83,20.82 46.83,23.02 ; 46.83,23.02 NOREF#4.1
DATA+: length 26.6
  Top Layer w0.254: v1(12.95,13.21) 12.95,13.18 8.76,8.99 8.76,8.51 8.72,8.47 ; USB1.A6 21.39,20.9 21.39,21.59 20.22,22.75 16.57,22.75 16.11,22.3 16.11,20.65 16.13,20.63 16.13,18.33 15.62,17.82 15.62,12.95 v1(16,12.57)
  Bottom Layer w0.254: v1(12.95,13.21) 15.37,13.21 v1(16,12.57)
DATA-: length 28.3
  Top Layer w0.254: U1.23 8.25,8.1 8.25,7.95 8.51,7.69 8.51,7.58 8.93,7.16 9.29,7.16 9.54,7.41 12.49,7.41 12.55,7.47 15.61,7.47 15.68,7.41 16.13,7.41 16.38,7.66 16.38,11.3 17.36,12.28 21.41,12.28 21.75,12.62 22.26,12.62 22.3,12.66 22.3,14.02 21.7,14.62 21.7,15.1 21.72,15.12 21.72,19.07 21.59,19.19 21.59,19.5 21.03,20.06 21.03,20.75 USB1.A7
GPIO3: length 48.5
  Top Layer w0.5: U1.7 1.15,16.1 1.57,16.1 4.45,13.22 4.45,10.03 v1(4.19,9.78)
  Bottom Layer w0.5: v1(28.32,21.97) 26.16,24.13 12.7,24.13 6.86,18.29 2.78,18.29 2.45,18.61 1.87,18.61 1.33,18.07 1.33,16.34 4.19,13.48 v1(4.19,9.78)
GPIO4: length 29.6
  Top Layer w0.3: U2.13 14.86,6.45 14.62,6.22 14.57,6.22 v2(14.45,6.1) ; v1(3.43,12.83) 3.43,12.96 1.6,14.79 1.6,14.97 1.42,15.15 1.25,15.15 U1.8
  Top Layer w0.5: v1(10.29,1.52) 11.68,2.92 v1(11.68,3.43)
  Bottom Layer w0.3: 14.48,5.97 14.22,5.97 12.32,4.06 ; v1(3.43,12.83) 3.43,12.52 2.31,11.4 2.31,3.69 2.95,3.05 8.76,3.05 v1(10.29,1.52)
  Bottom Layer w0.5: v1(11.68,3.43) 12.32,4.06
GPIO5: length 24.9
  Top Layer w0.3: v1(12.45,5.33) 12.18,5.6 12.18,6.42 12.09,6.5 12.09,6.63 12.5,7.03 14.06,7.03 14.24,6.85 U2.14 ; U1.9 1.25,14.3 1.42,14.3 1.6,14.12 1.6,13.8 2.92,12.48 v1(2.92,10.67)
  Top Layer w0.5: v1(9.14,3.81) 9.27,3.68 v1(10.41,3.68) ; v1(7.49,7.54) v1(3.05,7.54)
  Bottom Layer w0.3: 7.49,7.49 7.49,5.46 v1(9.14,3.81)
  Bottom Layer w0.5: v1(10.41,3.68) 10.8,3.68 v1(12.45,5.33) ; v1(3.05,7.54) 3.05,10.54 v1(2.92,10.67)
GPIOMTR1: length 53.6
  Top Layer w0.3: v1(24.26,12.24) 21.91,12.24 21.57,11.9 18,11.9 v1(17.65,11.56) ; R8.2 39.33,6.27 38.73,6.87 38.73,9.13 R3.1 33.26,13.59 v1(29.97,13.59)
  Top Layer w0.5: U1.5 1.04,17.91 v1(2.16,17.91)
  Bottom Layer w0.3: v1(17.65,11.56) 15.66,11.56 15.36,11.26 8.81,11.26 v1(2.16,17.91) ; v1(29.97,13.59) 25.61,13.59 v1(24.26,12.24)
GPIOMTR2: length 55
  Top Layer w0.5: v1(21.32,9.33) 23.05,9.33 23.62,9.91 24.25,9.91 25.74,11.4 31,11.4 R4.1 35.98,8.76 39.48,5.26 46.99,5.26 48.12,6.39 R9.1 ; U1.6 1.48,17.19 v1(2.03,16.64)
  Bottom Layer w0.5: v1(2.03,16.64) 2.58,16.64 8.46,10.75 19.9,10.75 v1(21.32,9.33)
V-MTR1: length 29.7
  Top Layer w0.5: 48.75,24.62 49.01,24.62 49.51,24.12 49.51,23.14 49.34,22.97 49.34,22.75 49.39,22.7 49.39,22.44 49.41,22.42 49.41,21.26 49.39,21.25 49.39,19.9 49.41,19.88 49.41,18.72 49.16,18.47 49.16,18.23 49.39,18 49.39,17.61 49.36,17.57 46.59,17.57 46.59,21.66 45.22,23.03 D4.2 ; v1(41.4,18.03) 41.4,18.02 Q2.3
  Bottom Layer w0.5: v1(41.4,18.03) 44.58,21.21 v1(44.58,22.61) 43.81,21.84 v1(40.51,21.84)
V-MTR2: length 12.2
  Top Layer w0.5: Q1.3 44.6,13.21 44.65,13.21 44.88,13.45 44.88,13.5 45.85,14.46 v1(45.85,16.92) 47.13,16.92 D5.2
  Bottom Layer w0.5: v1(45.85,16.92) 48.01,19.08 NOREF.2
$1N1566: length 11.4
  Top Layer w0.254: R1.2 18.03,13.46 v1(19.81,15.24)
  Top Layer w0.3: USB1.A5 22.46,20.1 22.1,19.74 22.1,15.37 22.29,15.18 v1(22.29,14.86)
  Bottom Layer w0.254: v1(22.29,14.86) 20.19,14.86 v1(19.81,15.24)
$1N1605: length 8.7
  Top Layer w0.254: R2.1 20.57,15.58 21.28,16.29 21.28,19 20.39,19.9 19.69,19.9 19.53,20.06 19.53,20.75 USB1.B5
$1N2351: length 2.4
  Top Layer w0.5: Q2.1 42.09,14.1 R3.2
$1N2390: length 2.7
  Top Layer w0.5: R4.2 41.2,8.76 Q1.1
$1N2578: length 7.8
  Top Layer w0.5: R5.2 42.48,22.12 40.28,19.91 40.28,19.08 39.74,18.54 38.4,18.54 38.16,18.3 38.16,17.8 37.9,17.54 U4.2
$1N2654: length 3.5
  Top Layer w0.5: U4.7 37.97,23.74 v1(37.97,24.38)
  Bottom Layer w0.5: v1(39.88,25.4) 38.86,24.38 v1(37.97,24.38)
$1N2866: length 3.7
  Top Layer w0.5: LED1.5 39.51,26.07 39.09,26.07 38.85,25.83 38.85,24.8 38.86,24.79 U4.6
$1N3463: length 24.3
  Top Layer w0.5: L1.2 27.85,12.32 v1(31.75,12.32) ; U5.1 36.86,2.19 36.86,3.01 36.62,3.24 30.69,3.24 30.62,3.17 D2.2 29.5,9.57 v1(29.84,9.91)
  Bottom Layer w0.5: v1(29.84,9.91) 29.84,10.41 v1(31.75,12.32)
$1N3668: length 26.4
  Top Layer w0.5: v1(35.56,14.48) 35.56,15.24 34.57,16.23 31.14,16.23 v1(30.48,16.89) 31.24,17.65 R11.2
  Bottom Layer w0.5: v1(39.88,0.76) 35.56,5.08 v1(35.56,14.48) ; v1(30.48,16.89) 28.7,16.89 v1(27.94,17.65)
$1N3802: length 47.4
  Top Layer w0.3: C1.2 18.16,16.19 v1(18.16,14.99)
  Top Layer w0.5: v1(2.92,3.94) 2.03,3.05 SW2.1 ; U1.45 14.6,21.2 14.28,21.2 13.34,20.25 v1(13.34,17.4) 13.34,16.76 10.53,13.95 10.53,13.08 10.29,12.84 8.14,12.84 v1(6.76,11.46)
  Bottom Layer w0.3: v1(25.17,7.77) 25.05,7.9 23.6,7.9 23.21,7.52 23.21,7.37 22.86,7.01 22.35,7.01 22,7.37 22,7.87 22.35,8.23 22.5,8.23 22.79,8.51 22.79,12.26 22.1,12.95 20.19,12.95 v1(18.16,14.99) ; v1(13.34,17.4) v1(17.02,17.4)
  Bottom Layer w0.5: v1(2.92,3.94) 6.76,7.77 v1(6.76,11.46)
$1N3847: length 46
  Top Layer w0.5: U1.4 1.15,18.65 2.42,18.65 5.22,15.84 5.22,10.92 6.57,9.58 7.15,9.58 7.47,9.89 v1(7.47,10.6)
  Bottom Layer w0.5: v1(7.47,10.6) 7.77,10.6 8.27,10.1 12.13,10.1 13.84,8.39 16.25,8.39 20.14,4.5 26.11,4.5 29.08,1.52 v1(35.56,1.52)

## Copper pours and planes (outline as drawn; the poured copper is in the pictures)
GND on Top Layer: 0,28.58 50.16,28.58 50.16,0 0,0

## Text on the board
Top Silkscreen Layer: BAT+ | GND | MTR2 | MTR1
